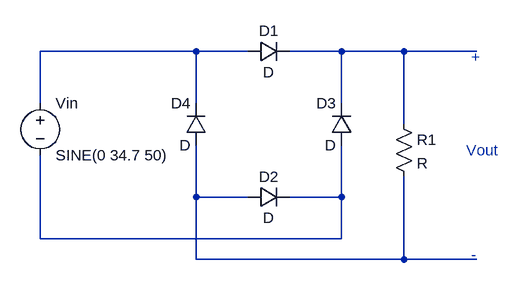
[diagram p0: schematic FullWaveCircuit.asc]
FullWaveCircuit.asc, the LTspice schematic file:
Version 4
SHEET 1 880 680
WIRE 320 208 80 208
WIRE 400 208 320 208
WIRE 544 208 464 208
WIRE 640 208 544 208
WIRE 752 208 640 208
WIRE 80 288 80 208
WIRE 320 288 320 208
WIRE 544 288 544 208
WIRE 640 320 640 208
WIRE 320 432 320 352
WIRE 400 432 320 432
WIRE 544 432 544 352
WIRE 544 432 464 432
WIRE 80 496 80 368
WIRE 544 496 544 432
WIRE 544 496 80 496
WIRE 320 528 320 432
WIRE 640 528 640 400
WIRE 640 528 320 528
WIRE 752 528 640 528
SYMBOL diode 400 224 R270
WINDOW 0 32 32 VTop 2
WINDOW 3 0 32 VBottom 2
SYMATTR InstName D1
SYMBOL diode 400 448 R270
WINDOW 0 32 32 VTop 2
WINDOW 3 0 32 VBottom 2
SYMATTR InstName D2
SYMBOL diode 560 352 R180
WINDOW 0 24 64 Left 2
WINDOW 3 24 0 Left 2
SYMATTR InstName D3
SYMBOL diode 336 352 R180
WINDOW 0 24 64 Left 2
WINDOW 3 24 0 Left 2
SYMATTR InstName D4
SYMBOL voltage 80 272 R0
SYMATTR InstName Vin
SYMATTR Value SINE(0 34.7 50)
SYMBOL res 624 304 R0
SYMATTR InstName R1
TEXT 736 360 Left 2 ;Vout
TEXT 744 216 Left 2 ;+
TEXT 744 520 Left 2 ;-

The netlist it stands for:
* FullWaveCircuit.asc
D1 N001 N002 D
D2 N003 N004 D
D3 N004 N002 D
D4 N003 N001 D
Vin N001 N004 SINE(0 34.7 50)
R1 N002 N003 R
.model D D
.lib standard.dio
* Vout
* +
* -
.backanno
.end